# Altium project genfreq.PrjPCB
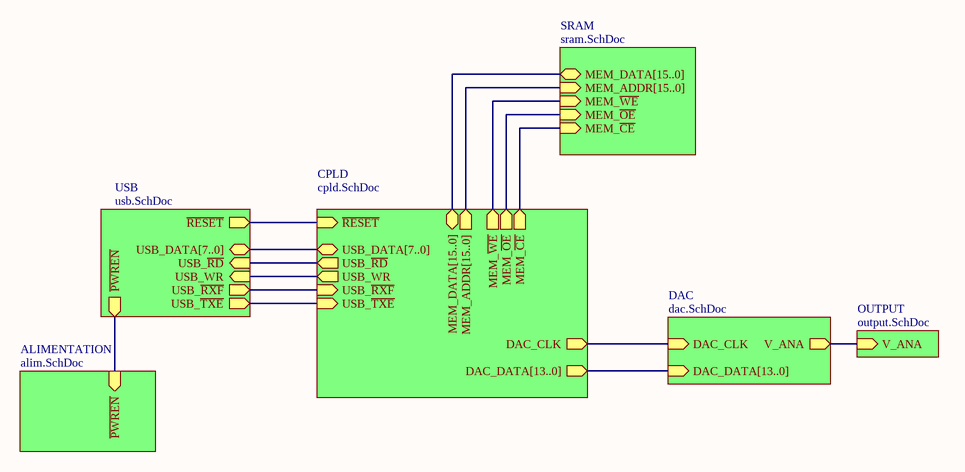
[diagram p0: global.SchDoc]
7 sheets, 119 parts. Net scope: hierarchical (ports join the sheet entries above them; power ports are global).
Board file: board.PcbDoc
Sheets:
  global.SchDoc
    USB = usb.SchDoc
    CPLD = cpld.SchDoc
    DAC = dac.SchDoc
    OUTPUT = output.SchDoc
    SRAM = sram.SchDoc
    ALIMENTATION = alim.SchDoc

## Sheet global.SchDoc
size A4

### Sub-sheets
ALIMENTATION = alim.SchDoc: ~{PWREN} (in)
CPLD = cpld.SchDoc: ~{RESET} (in), DAC_DATA[13..0] (out), USB_DATA[7..0] (bidir), USB_~{RD} (out), USB_WR (out), USB_~{RXF} (in), USB_~{TXE} (in), MEM_ADDR[15..0] (out), MEM_~{WE} (out), MEM_~{OE} (out), MEM_~{CE} (out), DAC_CLK (out), MEM_DATA[15..0] (bidir)
DAC = dac.SchDoc: V_ANA (out), DAC_DATA[13..0] (in), DAC_CLK (in)
OUTPUT = output.SchDoc: V_ANA (in)
SRAM = sram.SchDoc: MEM_DATA[15..0] (bidir), MEM_ADDR[15..0] (in), MEM_~{WE} (in), MEM_~{OE} (in), MEM_~{CE} (in)
USB = usb.SchDoc: ~{PWREN} (out), ~{RESET} (out), USB_DATA[7..0] (bidir), USB_~{RD} (in), USB_WR (in), USB_~{TXE} (out), USB_~{RXF} (out)

### Nets
DAC_CLK: sheet CPLD/DAC_CLK, sheet DAC/DAC_CLK
MEM_~{CE}: sheet CPLD/MEM_~{CE}, sheet SRAM/MEM_~{CE}
MEM_~{OE}: sheet CPLD/MEM_~{OE}, sheet SRAM/MEM_~{OE}
MEM_~{WE}: sheet CPLD/MEM_~{WE}, sheet SRAM/MEM_~{WE}
~{PWREN}: sheet USB/~{PWREN}, sheet ALIMENTATION/~{PWREN}
NetCPLD_28: sheet USB/USB_~{TXE}, sheet CPLD/USB_~{TXE}
NetCPLD_29: sheet USB/USB_~{RXF}, sheet CPLD/USB_~{RXF}
NetCPLD_30: sheet USB/USB_WR, sheet CPLD/USB_WR
NetCPLD_32: sheet USB/USB_~{RD}, sheet CPLD/USB_~{RD}
NetCPLD_44: sheet USB/~{RESET}, sheet CPLD/~{RESET}
NetDAC_22: sheet DAC/V_ANA, sheet OUTPUT/V_ANA

### Buses and harness runs
bus sheet CPLD/DAC_DATA[13..0] = sheet DAC/DAC_DATA[13..0]
bus sheet CPLD/MEM_ADDR[15..0] = sheet SRAM/MEM_ADDR[15..0]
bus sheet CPLD/MEM_DATA[15..0] = sheet SRAM/MEM_DATA[15..0]
bus sheet CPLD/USB_DATA[7..0] = sheet USB/USB_DATA[7..0]

## Sheet usb.SchDoc
size A4
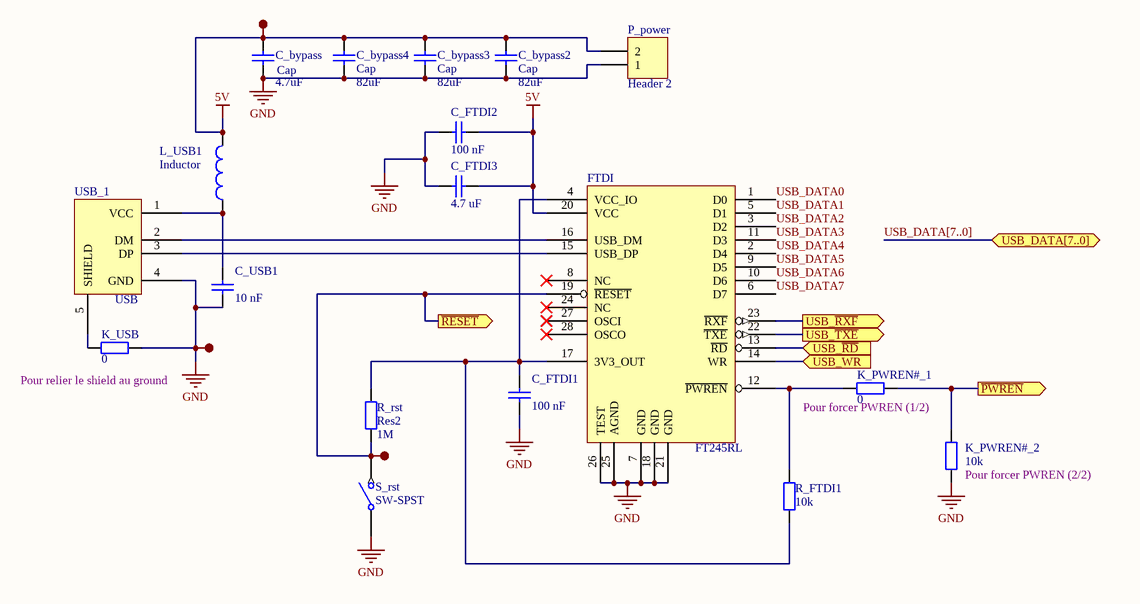
[diagram p1: usb.SchDoc]

### Parts
C_bypass  Cap  value 4.7uF  [0805]
C_bypass2  Cap  value 82uF  [Capacitor_bypass]
C_bypass3  Cap  value 82uF  [Capacitor_bypass]
C_bypass4  Cap  value 82uF  [Capacitor_bypass]
C_FTDI1  value 100 nF  [0805]  (hidden comment: Cap)
C_FTDI2  value 100 nF  [0805]  (hidden comment: Cap)
C_FTDI3  value 4.7 uF  [0805]  (hidden comment: Cap)
C_USB1  value 10 nF  [0805]  (hidden comment: Cap)
FTDI  FT245RL  [SSOP28]
K_PWREN#_1  value 0  [0805]  (hidden comment: Res2)
K_PWREN#_2  value 10k  [0805]  (hidden comment: Res2)
K_USB  value 0  [0805]  (hidden comment: Res2)
L_USB1  Inductor  [0805]
P_power  Header 2  [HDR1X2]
R_FTDI1  value 10k  [0805]  (hidden comment: Res2)
R_rst  Res2  value 1M  [0805]
S_rst  SW-SPST  [0805]
TP_5v  TestPoint  [testpoint]  (value not drawn)
TP_gnd  TestPoint  [testpoint]  (value not drawn)
TP_reset  TestPoint  [testpoint]  (value not drawn)
USB_1  USB  [USB2.5-2H4E]

### Ports
USB_DATA[7..0] (bidir), USB_WR (in), USB_~{RD} (in), USB_~{RXF} (out), USB_~{TXE} (out), ~{PWREN} (out), ~{RESET} (out)

### Nets
5V: C_bypass.1 C_bypass2.1 C_bypass3.1 C_bypass4.1 C_FTDI2.2 C_FTDI3.2 FTDI.20(VCC) L_USB1.2 P_power.2 TP_5v.1(TP)
GND: C_bypass.2 C_bypass2.2 C_bypass3.2 C_bypass4.2 C_FTDI1.2 C_FTDI2.1 C_FTDI3.1 C_USB1.2 FTDI.7(GND) FTDI.18(GND) FTDI.21(GND) FTDI.25(AGND) FTDI.26(TEST) K_PWREN#_2.2 K_USB.2 P_power.1 S_rst.1(COMMON) TP_gnd.1(TP) USB_1.4(GND)  [project net AGND]
~{PWREN}: K_PWREN#_1.2 K_PWREN#_2.1 ; port ~{PWREN}
USB_DATA0: FTDI.1(D0)
USB_DATA1: FTDI.5(D1)
USB_DATA2: FTDI.3(D2)
USB_DATA3: FTDI.11(D3)
USB_DATA4: FTDI.2(D4)
USB_DATA5: FTDI.9(D5)
USB_DATA6: FTDI.10(D6)
USB_DATA7: FTDI.6(D7)
NetC_FTDI1_1: C_FTDI1.1 FTDI.4(VCC_IO) FTDI.17(3V3_OUT) R_FTDI1.2 R_rst.2
NetC_USB1_1: C_USB1.1 L_USB1.1 USB_1.1(VCC)
NetCPLD_28: FTDI.22(~{TXE}) ; port USB_~{TXE}
NetCPLD_29: FTDI.23(~{RXF}) ; port USB_~{RXF}
NetCPLD_30: FTDI.14(WR) ; port USB_WR
NetCPLD_32: FTDI.13(~{RD}) ; port USB_~{RD}
NetCPLD_44: FTDI.19(~{RESET}) R_rst.1 S_rst.2(NO) TP_reset.1(TP) ; port ~{RESET}
NetFTDI_12: FTDI.12(~{PWREN}) K_PWREN#_1.1 R_FTDI1.1
NetFTDI_15: FTDI.15(USB_DP) USB_1.3(DP)
NetFTDI_16: FTDI.16(USB_DM) USB_1.2(DM)
NetK_USB_1: K_USB.1 USB_1.5(SHIELD)

Not connected (* = marked no-connect by the designer): FTDI 8(NC)* 24(NC)* 27(OSCI)* 28(OSCO)*

### Buses and harness runs
bus USB_DATA[7..0] = port USB_DATA[7..0]

### Notes on the sheet
- Pour relier le shield au ground
- (near K_PWREN#_1) Pour forcer PWREN (1/2)
- (near K_PWREN#_2) Pour forcer PWREN (2/2)

### Library data of the parts
C_bypass C_bypass2-C_bypass4 C_FTDI1-C_FTDI3 C_USB1 = Cap: Capacitor; Published: 8-Jun-2000; LatestRevisionDate: 17-Jul-2002; LatestRevisionNote: Re-released for DXP Platform.; PackageReference: RAD-0.3; Publisher: Altium Limited
K_PWREN#_1 K_PWREN#_2 K_USB R_FTDI1 R_rst = Res2: Resistor; Published: 8-Jun-2000; LatestRevisionDate: 17-Jul-2002; LatestRevisionNote: Re-released for DXP Platform.; PackageReference: AXIAL-0.4; Publisher: Altium Limited
L_USB1 = Inductor: Code_IEC: 1005; Published: 8-Jun-2000; LatestRevisionDate: 29-May-2009; LatestRevisionNote: IPC-7351 Footprint Added.; PackageReference: 0402-A; Publisher: Altium Limited; PackageDescription: Chip Inductor; Code_JEITA: 0402
P_power = Header 2: Header, 2-Pin; LatestRevisionDate: 17-Jul-2002; LatestRevisionNote: Re-released for DXP Platform.; Publisher: Altium Limited
S_rst = SW-SPST: Single-Pole, Single-Throw Switch; Published: 24-Mar-1999; LatestRevisionDate: 17-Jul-2002; LatestRevisionNote: Re-released for DXP Platform.; PackageReference: SPST-2; Publisher: Altium Limited

## Sheet cpld.SchDoc
size A4
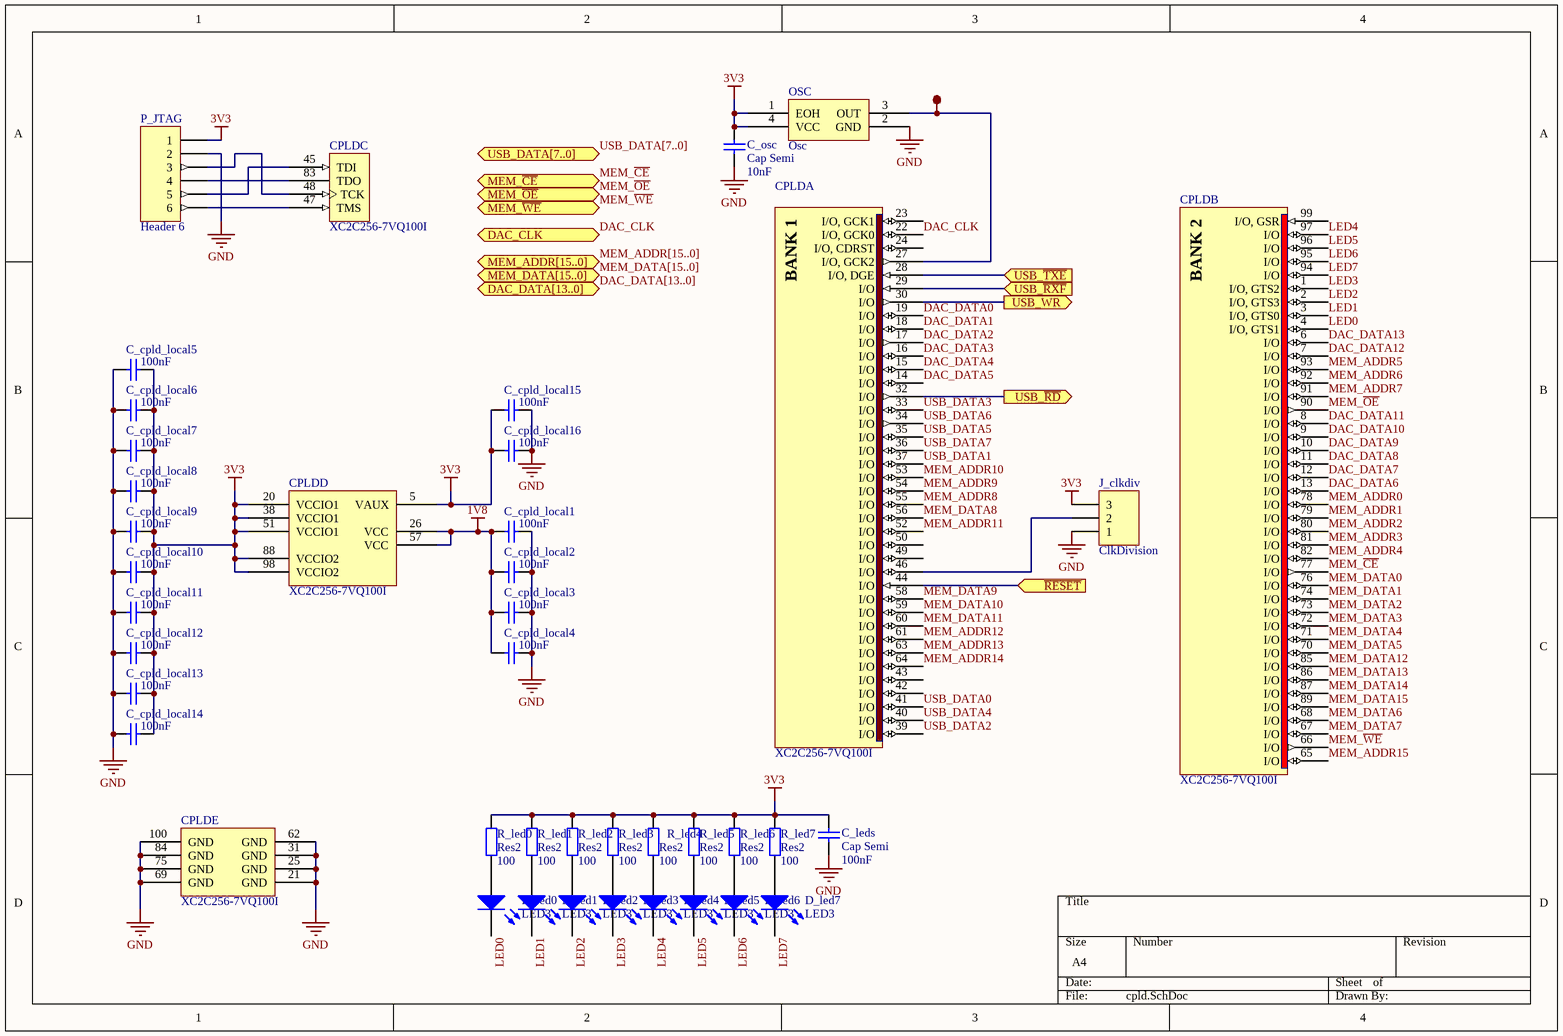
[diagram p2: cpld.SchDoc]

### Parts
C_cpld_local1  value 100nF  [0805]  (hidden comment: Cap Semi)
C_cpld_local2  value 100nF  [0805]  (hidden comment: Cap Semi)
C_cpld_local3  value 100nF  [0805]  (hidden comment: Cap Semi)
C_cpld_local4  value 100nF  [0805]  (hidden comment: Cap Semi)
C_cpld_local5  value 100nF  [0805]  (hidden comment: Cap Semi)
C_cpld_local6  value 100nF  [0805]  (hidden comment: Cap Semi)
C_cpld_local7  value 100nF  [0805]  (hidden comment: Cap Semi)
C_cpld_local8  value 100nF  [0805]  (hidden comment: Cap Semi)
C_cpld_local9  value 100nF  [0805]  (hidden comment: Cap Semi)
C_cpld_local10  value 100nF  [0805]  (hidden comment: Cap Semi)
C_cpld_local11  value 100nF  [0805]  (hidden comment: Cap Semi)
C_cpld_local12  value 100nF  [0805]  (hidden comment: Cap Semi)
C_cpld_local13  value 100nF  [0805]  (hidden comment: Cap Semi)
C_cpld_local14  value 100nF  [0805]  (hidden comment: Cap Semi)
C_cpld_local15  value 100nF  [0805]  (hidden comment: Cap Semi)
C_cpld_local16  value 100nF  [0805]  (hidden comment: Cap Semi)
C_leds  Cap Semi  value 100nF  [0805]
C_osc  Cap Semi  value 10nF  [0805]
CPLD  XC2C256-7VQ100I  [VQ100_N]  (parts A,B,C,D,E of 5)
D_led0  LED3  [0805]
D_led1  LED3  [0805]
D_led2  LED3  [0805]
D_led3  LED3  [0805]
D_led4  LED3  [0805]
D_led5  LED3  [0805]
D_led6  LED3  [0805]
D_led7  LED3  [0805]
J_clkdiv  ClkDivision  [HDR1X3]
OSC  Osc  [OSC]
P_JTAG  Header 6  [HDR1X6]
R_led0  Res2  value 100  [0805]
R_led1  Res2  value 100  [0805]
R_led2  Res2  value 100  [0805]
R_led3  Res2  value 100  [0805]
R_led4  Res2  value 100  [0805]
R_led5  Res2  value 100  [0805]
R_led6  Res2  value 100  [0805]
R_led7  Res2  value 100  [0805]
TP_osc  TestPoint  [testpoint]  (value not drawn)

### Ports
DAC_CLK (out), DAC_DATA[13..0] (out), MEM_ADDR[15..0] (out), MEM_DATA[15..0] (bidir), MEM_~{CE} (out), MEM_~{OE} (out), MEM_~{WE} (out), USB_DATA[7..0] (bidir), USB_WR (out), USB_~{RD} (out), USB_~{RXF} (in), USB_~{TXE} (in), ~{RESET} (in)

### Nets
1V8: C_cpld_local1.2 C_cpld_local2.2 C_cpld_local3.2 C_cpld_local4.2 CPLD.26(VCC) CPLD.57(VCC)
3V3: C_cpld_local5.1 C_cpld_local6.1 C_cpld_local7.1 C_cpld_local8.1 C_cpld_local9.1 C_cpld_local10.1 C_cpld_local11.1 C_cpld_local12.1 C_cpld_local13.1 C_cpld_local14.1 C_cpld_local15.2 C_cpld_local16.2 C_leds.2 C_osc.2 CPLD.5(VAUX) CPLD.20(VCCIO1) CPLD.38(VCCIO1) CPLD.51(VCCIO1) CPLD.88(VCCIO2) CPLD.98(VCCIO2) J_clkdiv.3 OSC.1(EOH) OSC.4(VCC) P_JTAG.1 R_led0.2 R_led1.2 R_led2.2 R_led3.2 R_led4.2 R_led5.2 R_led6.2 R_led7.2
GND: C_cpld_local1.1 C_cpld_local2.1 C_cpld_local3.1 C_cpld_local4.1 C_cpld_local5.2 C_cpld_local6.2 C_cpld_local7.2 C_cpld_local8.2 C_cpld_local9.2 C_cpld_local10.2 C_cpld_local11.2 C_cpld_local12.2 C_cpld_local13.2 C_cpld_local14.2 C_cpld_local15.1 C_cpld_local16.1 C_leds.1 C_osc.1 CPLD.21(GND) CPLD.25(GND) CPLD.31(GND) CPLD.62(GND) CPLD.69(GND) CPLD.75(GND) CPLD.84(GND) CPLD.100(GND) J_clkdiv.1 OSC.2(GND) P_JTAG.2  [project net AGND]
DAC_CLK: CPLD.22(I/O,_GCK0) ; port DAC_CLK
DAC_DATA0: CPLD.19(I/O)
DAC_DATA1: CPLD.18(I/O)
DAC_DATA2: CPLD.17(I/O)
DAC_DATA3: CPLD.16(I/O)
DAC_DATA4: CPLD.15(I/O)
DAC_DATA5: CPLD.14(I/O)
DAC_DATA6: CPLD.13(I/O)
DAC_DATA7: CPLD.12(I/O)
DAC_DATA8: CPLD.11(I/O)
DAC_DATA9: CPLD.10(I/O)
DAC_DATA10: CPLD.9(I/O)
DAC_DATA11: CPLD.8(I/O)
DAC_DATA12: CPLD.7(I/O)
DAC_DATA13: CPLD.6(I/O)
LED0: CPLD.4(I/O,_GTS1) D_led0.2(K)
LED1: CPLD.3(I/O,_GTS0) D_led1.2(K)
LED2: CPLD.2(I/O,_GTS3) D_led2.2(K)
LED3: CPLD.1(I/O,_GTS2) D_led3.2(K)
LED4: CPLD.97(I/O) D_led4.2(K)
LED5: CPLD.96(I/O) D_led5.2(K)
LED6: CPLD.95(I/O) D_led6.2(K)
LED7: CPLD.94(I/O) D_led7.2(K)
MEM_ADDR0: CPLD.78(I/O)
MEM_ADDR1: CPLD.79(I/O)
MEM_ADDR2: CPLD.80(I/O)
MEM_ADDR3: CPLD.81(I/O)
MEM_ADDR4: CPLD.82(I/O)
MEM_ADDR5: CPLD.93(I/O)
MEM_ADDR6: CPLD.92(I/O)
MEM_ADDR7: CPLD.91(I/O)
MEM_ADDR8: CPLD.55(I/O)
MEM_ADDR9: CPLD.54(I/O)
MEM_ADDR10: CPLD.53(I/O)
MEM_ADDR11: CPLD.52(I/O)
MEM_ADDR12: CPLD.61(I/O)
MEM_ADDR13: CPLD.63(I/O)
MEM_ADDR14: CPLD.64(I/O)
MEM_ADDR15: CPLD.65(I/O)
MEM_~{CE}: CPLD.77(I/O) ; port MEM_~{CE}
MEM_DATA0: CPLD.76(I/O)
MEM_DATA1: CPLD.74(I/O)
MEM_DATA2: CPLD.73(I/O)
MEM_DATA3: CPLD.72(I/O)
MEM_DATA4: CPLD.71(I/O)
MEM_DATA5: CPLD.70(I/O)
MEM_DATA6: CPLD.68(I/O)
MEM_DATA7: CPLD.67(I/O)
MEM_DATA8: CPLD.56(I/O)
MEM_DATA9: CPLD.58(I/O)
MEM_DATA10: CPLD.59(I/O)
MEM_DATA11: CPLD.60(I/O)
MEM_DATA12: CPLD.85(I/O)
MEM_DATA13: CPLD.86(I/O)
MEM_DATA14: CPLD.87(I/O)
MEM_DATA15: CPLD.89(I/O)
MEM_~{OE}: CPLD.90(I/O) ; port MEM_~{OE}
MEM_~{WE}: CPLD.66(I/O) ; port MEM_~{WE}
USB_DATA0: CPLD.41(I/O)
USB_DATA1: CPLD.37(I/O)
USB_DATA2: CPLD.39(I/O)
USB_DATA3: CPLD.33(I/O)
USB_DATA4: CPLD.40(I/O)
USB_DATA5: CPLD.35(I/O)
USB_DATA6: CPLD.34(I/O)
USB_DATA7: CPLD.36(I/O)
NetCPLD_27: CPLD.27(I/O,_GCK2) OSC.3(OUT) TP_osc.1(TP)
NetCPLD_28: CPLD.28(I/O,_DGE) ; port USB_~{TXE}
NetCPLD_29: CPLD.29(I/O) ; port USB_~{RXF}
NetCPLD_30: CPLD.30(I/O) ; port USB_WR
NetCPLD_32: CPLD.32(I/O) ; port USB_~{RD}
NetCPLD_44: CPLD.44(I/O) ; port ~{RESET}
NetCPLD_45: CPLD.45(TDI) P_JTAG.5
NetCPLD_46: CPLD.46(I/O) J_clkdiv.2
NetCPLD_47: CPLD.47(TMS) P_JTAG.6
NetCPLD_48: CPLD.48(TCK) P_JTAG.3
NetCPLD_83: CPLD.83(TDO) P_JTAG.4
NetD_led0_1: D_led0.1(A) R_led0.1
NetD_led1_1: D_led1.1(A) R_led1.1
NetD_led2_1: D_led2.1(A) R_led2.1
NetD_led3_1: D_led3.1(A) R_led3.1
NetD_led4_1: D_led4.1(A) R_led4.1
NetD_led5_1: D_led5.1(A) R_led5.1
NetD_led6_1: D_led6.1(A) R_led6.1
NetD_led7_1: D_led7.1(A) R_led7.1

Not connected (* = marked no-connect by the designer): CPLD 23(I/O,_GCK1) 24(I/O,_CDRST) 42(I/O) 43(I/O) 49(I/O) 50(I/O) 99(I/O,_GSR)

### Buses and harness runs
bus DAC_DATA[13..0] = port DAC_DATA[13..0]
bus MEM_ADDR[15..0] = port MEM_ADDR[15..0]
bus MEM_DATA[15..0] = port MEM_DATA[15..0]
bus USB_DATA[7..0] = port USB_DATA[7..0]

### Notes on the sheet
- (in symbol XC2C256-7VQ100I, part A) BANK 1
- (in symbol XC2C256-7VQ100I, part B) BANK 2

### Library data of the parts
C_cpld_local1-C_cpld_local16 C_leds C_osc = Cap Semi: Capacitor (Semiconductor SIM Model); Published: 8-Jun-2000; LatestRevisionDate: 29-May-2009; LatestRevisionNote: IPC-7351 Footprint Added.; PackageReference: C1206; Publisher: Altium Limited; PackageDescription: Chip Capacitor
CPLD = XC2C256-7VQ100I: CoolRunner-II 1.8V, 256 Macrocell CPLD, 80 User I/Os, 100-Pin VQFP, Industrial Grade; FirstPublished: 23-Sep-2002; LatestRevisionDate: 30-Oct-2009; LatestRevisionNote: Updated to datasheet version 3.1 Sep-2008.; DatasheetVersion: ver3.2, Mar-2007; PackageVersion: ver1.2.1, Feb-2007; PackageReference: VQ100; Publisher: Altium Limited; PackageDescription: 100-Pin Very Thin Quad Flat Pack (VQ100); Code_JEDEC: MS-026-AED; ComponentLink1Description: XC2C256 Datasheet; ComponentLink1URL: http://www.xilinx.com/support/documentation/data_sheets/ds094.pdf; ComponentLink2Description: VQ100 Package Drawing; ComponentLink2URL: http://www.xilinx.com/support/documentation/package_specs/vq100.pdf; ComponentLink3Description: CoolRunner-II Documents; ComponentLink3URL: http://www.xilinx.com/support/documentation/coolrunner-ii.htm; ComponentLink4Description: Xilinx.com Home; ComponentLink4URL: http://www.xilinx.com
D_led0-D_led7 = LED3: Typical BLUE SiC LED; Published: 8-Jun-2000; LatestRevisionDate: 17-Dec-2003; LatestRevisionNote: PCB Footprint replaced.; DatasheetVersion: 16-Apr-2002; PackageVersion: 16-Apr-2002; PackageReference: 3.5X2.8X1.9; Publisher: Altium Limited
J_clkdiv = Header 3: Header, 3-Pin; LatestRevisionDate: 17-Jul-2002; LatestRevisionNote: Re-released for DXP Platform.; Publisher: Altium Limited
P_JTAG = Header 6: Header, 6-Pin; LatestRevisionDate: 17-Jul-2002; LatestRevisionNote: Re-released for DXP Platform.; Publisher: Altium Limited
R_led0-R_led7 = Res2: Resistor; Published: 8-Jun-2000; LatestRevisionDate: 17-Jul-2002; LatestRevisionNote: Re-released for DXP Platform.; PackageReference: AXIAL-0.4; Publisher: Altium Limited

## Sheet dac.SchDoc
size A4
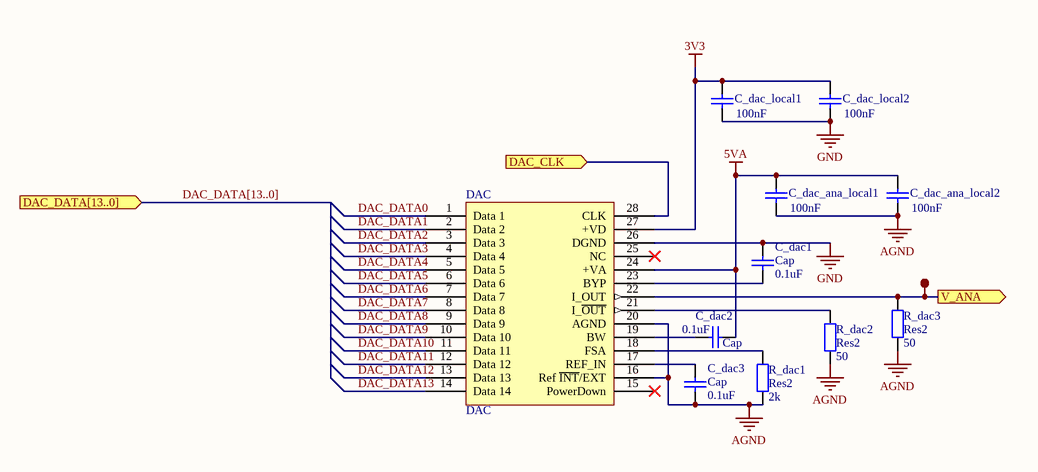
[diagram p3: dac.SchDoc]

### Parts
C_dac1  Cap  value 0.1uF  [0805]
C_dac2  Cap  value 0.1uF  [0805]
C_dac3  Cap  value 0.1uF  [0805]
C_dac_ana_local1  value 100nF  [0805]  (hidden comment: Cap Semi)
C_dac_ana_local2  value 100nF  [0805]  (hidden comment: Cap Semi)
C_dac_local1  value 100nF  [0805]  (hidden comment: Cap Semi)
C_dac_local2  value 100nF  [0805]  (hidden comment: Cap Semi)
DAC  DAC  [SOIC28]
R_dac1  Res2  value 2k  [0805]
R_dac2  Res2  value 50  [0805]
R_dac3  Res2  value 50  [0805]
TP_vout  TestPoint  [testpoint]  (value not drawn)

### Ports
DAC_CLK (in), DAC_DATA[13..0] (in), V_ANA (out)

### Nets
3V3: C_dac_local1.2 C_dac_local2.2 DAC.27(+VD)
5VA: C_dac2.1 C_dac_ana_local1.2 C_dac_ana_local2.2 DAC.24(+VA)
AGND: C_dac1.1 C_dac3.2 C_dac_ana_local1.1 C_dac_ana_local2.1 C_dac_local1.1 C_dac_local2.1 DAC.16(Ref_~{INT}/EXT) DAC.20(AGND) DAC.26(DGND) R_dac1.1 R_dac2.1 R_dac3.1  [also labelled GND]
DAC_CLK: DAC.28(CLK) ; port DAC_CLK
DAC_DATA0: DAC.1(Data_1)
DAC_DATA1: DAC.2(Data_2)
DAC_DATA2: DAC.3(Data_3)
DAC_DATA3: DAC.4(Data_4)
DAC_DATA4: DAC.5(Data_5)
DAC_DATA5: DAC.6(Data_6)
DAC_DATA6: DAC.7(Data_7)
DAC_DATA7: DAC.8(Data_8)
DAC_DATA8: DAC.9(Data_9)
DAC_DATA9: DAC.10(Data_10)
DAC_DATA10: DAC.11(Data_11)
DAC_DATA11: DAC.12(Data_12)
DAC_DATA12: DAC.13(Data_13)
DAC_DATA13: DAC.14(Data_14)
NetC_dac1_2: C_dac1.2 DAC.23(BYP)
NetC_dac2_2: C_dac2.2 DAC.19(BW)
NetC_dac3_1: C_dac3.1 DAC.17(REF_IN)
NetDAC_18: DAC.18(FSA) R_dac1.2
NetDAC_21: DAC.21(I_~{OUT}) R_dac2.2
NetDAC_22: DAC.22(I_OUT) R_dac3.2 TP_vout.1(TP) ; port V_ANA

Not connected (* = marked no-connect by the designer): DAC 15(PowerDown)* 25(NC)*

### Buses and harness runs
bus DAC_DATA[13..0] = port DAC_DATA[13..0]

### Library data of the parts
C_dac1-C_dac3 = Cap: Capacitor; Published: 8-Jun-2000; LatestRevisionDate: 17-Jul-2002; LatestRevisionNote: Re-released for DXP Platform.; PackageReference: RAD-0.3; Publisher: Altium Limited
C_dac_ana_local1 C_dac_ana_local2 C_dac_local1 C_dac_local2 = Cap Semi: Capacitor (Semiconductor SIM Model); Published: 8-Jun-2000; LatestRevisionDate: 29-May-2009; LatestRevisionNote: IPC-7351 Footprint Added.; PackageReference: C1206; Publisher: Altium Limited; PackageDescription: Chip Capacitor
R_dac1-R_dac3 = Res2: Resistor; Published: 8-Jun-2000; LatestRevisionDate: 17-Jul-2002; LatestRevisionNote: Re-released for DXP Platform.; PackageReference: AXIAL-0.4; Publisher: Altium Limited

## Sheet output.SchDoc
size A4
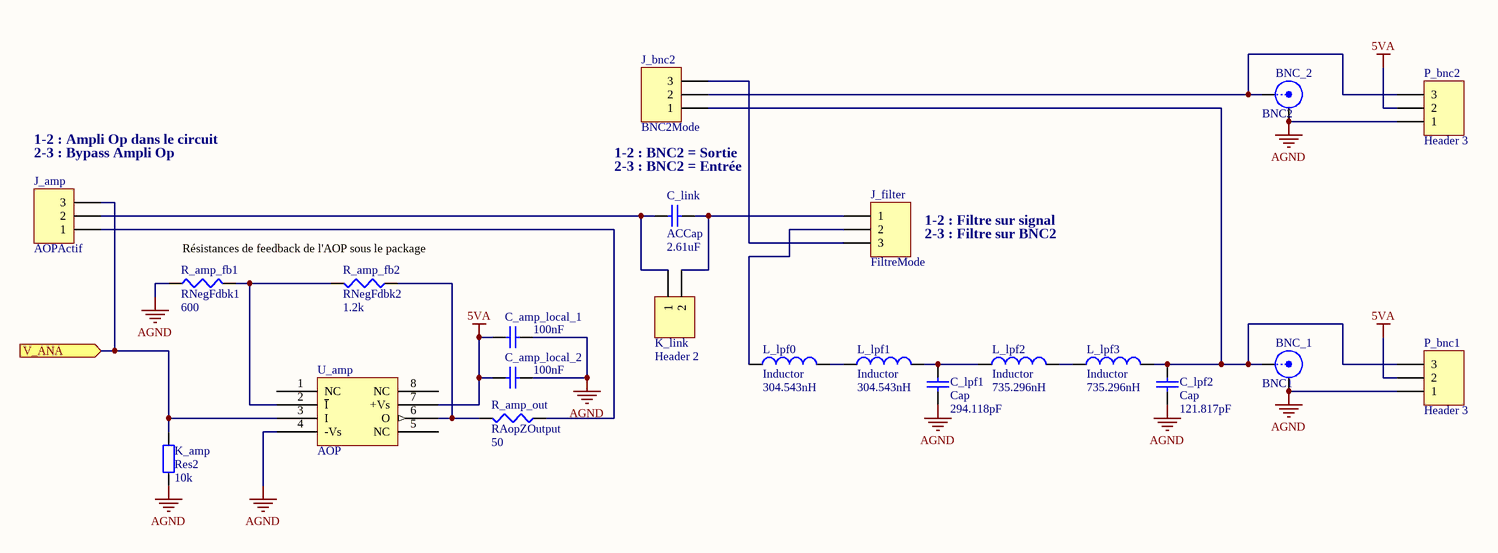
[diagram p4: output.SchDoc]

### Parts
BNC_1  BNC1  [BNC_RA CON]
BNC_2  BNC2  [BNC_RA CON]
C_amp_local_1  value 100nF  [0805]  (hidden comment: Cap Semi)
C_amp_local_2  value 100nF  [0805]  (hidden comment: Cap Semi)
C_link  ACCap  value 2.61uF  [0805]
C_lpf1  Cap  value 294.118pF  [0805]
C_lpf2  Cap  value 121.817pF  [0805]
J_amp  AOPActif  [HDR1X3]
J_bnc2  BNC2Mode  [HDR1X3]
J_filter  FiltreMode  [HDR1X3]
K_amp  Res2  value 10k  [0805]
K_link  Header 2  [HDR1X2]
L_lpf0  Inductor  value 304.543nH  [0805]
L_lpf1  Inductor  value 304.543nH  [0805]
L_lpf2  Inductor  value 735.296nH  [0805]
L_lpf3  Inductor  value 735.296nH  [0805]
P_bnc1  Header 3  [HDR1X3]
P_bnc2  Header 3  [HDR1X3]
R_amp_fb1  RNegFdbk1  value 600  [0805]
R_amp_fb2  RNegFdbk2  value 1.2k  [0805]
R_amp_out  RAopZOutput  value 50  [0805]
U_amp  AOP  [SOIC127P600-8CN]

### Ports
V_ANA (in)

### Nets
5VA: C_amp_local_1.2 C_amp_local_2.2 P_bnc1.2 P_bnc2.2 U_amp.7(+Vs)
AGND: BNC_1.2(Y) BNC_2.2(Y) C_amp_local_1.1 C_amp_local_2.1 C_lpf1.1 C_lpf2.1 K_amp.1 P_bnc1.1 P_bnc2.1 R_amp_fb1.1 U_amp.4(-Vs)
NetBNC_1_1: BNC_1.1(X) C_lpf2.2 J_bnc2.1 L_lpf3.2 P_bnc1.3
NetBNC_2_1: BNC_2.1(X) J_bnc2.2 P_bnc2.3
NetC_link_1: C_link.1 J_amp.2 K_link.1
NetC_link_2: C_link.2 J_filter.1 K_link.2
NetC_lpf1_2: C_lpf1.2 L_lpf1.2 L_lpf2.1
NetDAC_22: J_amp.3 K_amp.2 U_amp.3(I) ; port V_ANA
NetJ_amp_1: J_amp.1 R_amp_out.1
NetJ_bnc2_3: J_bnc2.3 J_filter.3
NetJ_filter_2: J_filter.2 L_lpf0.1
NetL_lpf0_2: L_lpf0.2 L_lpf1.1
NetL_lpf2_2: L_lpf2.2 L_lpf3.1
NetR_amp_fb1_2: R_amp_fb1.2 R_amp_fb2.2 U_amp.2(~{I})
NetR_amp_fb2_1: R_amp_fb2.1 R_amp_out.2 U_amp.6(O)

Not connected (* = marked no-connect by the designer): U_amp 1(NC) 5(NC) 8(NC)

### Notes on the sheet
- 1-2 : Ampli Op dans le circuit
- (near J_amp) 2-3 : Bypass Ampli Op
- 1-2 : BNC2 = Sortie
- 2-3 : BNC2 = Entrée
- Résistances de feedback de l'AOP sous le package
- 1-2 : Filtre sur signal
- 2-3 : Filtre sur BNC2

### Library data of the parts
BNC_1 BNC_2 = BNC: BNC Elbow Connector; LatestRevisionDate: 17-Jul-2002; LatestRevisionNote: Re-released for DXP Platform.; Publisher: Altium Limited
C_amp_local_1 C_amp_local_2 = Cap Semi: Capacitor (Semiconductor SIM Model); Published: 8-Jun-2000; LatestRevisionDate: 29-May-2009; LatestRevisionNote: IPC-7351 Footprint Added.; PackageReference: C1206; Publisher: Altium Limited; PackageDescription: Chip Capacitor
C_link C_lpf1 C_lpf2 = Cap: Capacitor; Published: 8-Jun-2000; LatestRevisionDate: 17-Jul-2002; LatestRevisionNote: Re-released for DXP Platform.; PackageReference: RAD-0.3; Publisher: Altium Limited
J_amp J_bnc2 J_filter P_bnc1 P_bnc2 = Header 3: Header, 3-Pin; LatestRevisionDate: 17-Jul-2002; LatestRevisionNote: Re-released for DXP Platform.; Publisher: Altium Limited
K_amp = Res2: Resistor; Published: 8-Jun-2000; LatestRevisionDate: 17-Jul-2002; LatestRevisionNote: Re-released for DXP Platform.; PackageReference: AXIAL-0.4; Publisher: Altium Limited
K_link = Header 2: Header, 2-Pin; LatestRevisionDate: 17-Jul-2002; LatestRevisionNote: Re-released for DXP Platform.; Publisher: Altium Limited
L_lpf0-L_lpf3 = Inductor: Code_IEC: 1005; Published: 8-Jun-2000; LatestRevisionDate: 29-May-2009; LatestRevisionNote: IPC-7351 Footprint Added.; PackageReference: 0402-A; Publisher: Altium Limited; PackageDescription: Chip Inductor; Code_JEITA: 0402
R_amp_fb1 R_amp_fb2 R_amp_out = Res3: Resistor; Published: 8-Jun-2000; LatestRevisionDate: 29-May-2009; LatestRevisionNote: IPC-7351 Footprint Added.; PackageReference: J1-0603; Publisher: Altium Limited; PackageDescription: Chip Resistor

## Sheet sram.SchDoc
size A4
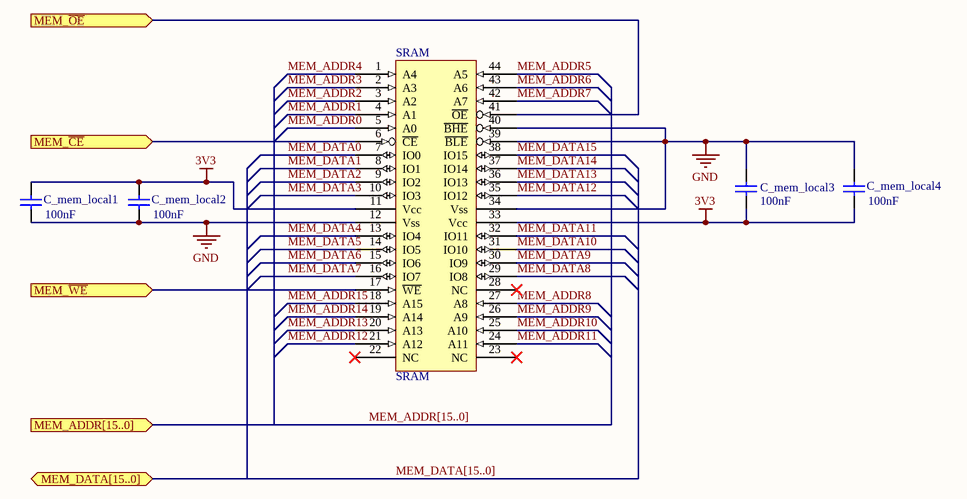
[diagram p5: sram.SchDoc]

### Parts
C_mem_local1  value 100nF  [0805]  (hidden comment: Cap Semi)
C_mem_local2  value 100nF  [0805]  (hidden comment: Cap Semi)
C_mem_local3  value 100nF  [0805]  (hidden comment: Cap Semi)
C_mem_local4  value 100nF  [0805]  (hidden comment: Cap Semi)
SRAM  SRAM  [TSOP44]

### Ports
MEM_ADDR[15..0] (in), MEM_DATA[15..0] (bidir), MEM_~{CE} (in), MEM_~{OE} (in), MEM_~{WE} (in)

### Nets
3V3: C_mem_local1.2 C_mem_local2.2 C_mem_local3.1 C_mem_local4.1 SRAM.11(Vcc) SRAM.33(Vcc)
GND: C_mem_local1.1 C_mem_local2.1 C_mem_local3.2 C_mem_local4.2 SRAM.12(Vss) SRAM.34(Vss) SRAM.39(~{BLE}) SRAM.40(~{BHE})  [project net AGND]
MEM_ADDR0: SRAM.5(A0)
MEM_ADDR1: SRAM.4(A1)
MEM_ADDR2: SRAM.3(A2)
MEM_ADDR3: SRAM.2(A3)
MEM_ADDR4: SRAM.1(A4)
MEM_ADDR5: SRAM.44(A5)
MEM_ADDR6: SRAM.43(A6)
MEM_ADDR7: SRAM.42(A7)
MEM_ADDR8: SRAM.27(A8)
MEM_ADDR9: SRAM.26(A9)
MEM_ADDR10: SRAM.25(A10)
MEM_ADDR11: SRAM.24(A11)
MEM_ADDR12: SRAM.21(A12)
MEM_ADDR13: SRAM.20(A13)
MEM_ADDR14: SRAM.19(A14)
MEM_ADDR15: SRAM.18(A15)
MEM_~{CE}: SRAM.6(~{CE}) ; port MEM_~{CE}
MEM_DATA0: SRAM.7(IO0)
MEM_DATA1: SRAM.8(IO1)
MEM_DATA2: SRAM.9(IO2)
MEM_DATA3: SRAM.10(IO3)
MEM_DATA4: SRAM.13(IO4)
MEM_DATA5: SRAM.14(IO5)
MEM_DATA6: SRAM.15(IO6)
MEM_DATA7: SRAM.16(IO7)
MEM_DATA8: SRAM.29(IO8)
MEM_DATA9: SRAM.30(IO9)
MEM_DATA10: SRAM.31(IO10)
MEM_DATA11: SRAM.32(IO11)
MEM_DATA12: SRAM.35(IO12)
MEM_DATA13: SRAM.36(IO13)
MEM_DATA14: SRAM.37(IO14)
MEM_DATA15: SRAM.38(IO15)
MEM_~{OE}: SRAM.41(~{OE}) ; port MEM_~{OE}
MEM_~{WE}: SRAM.17(~{WE}) ; port MEM_~{WE}

Not connected (* = marked no-connect by the designer): SRAM 22(NC)* 23(NC)* 28(NC)*

### Buses and harness runs
bus MEM_ADDR[15..0] = port MEM_ADDR[15..0]
bus MEM_DATA[15..0] = port MEM_DATA[15..0]

### Library data of the parts
C_mem_local1-C_mem_local4 = Cap Semi: Capacitor (Semiconductor SIM Model); Published: 8-Jun-2000; LatestRevisionDate: 29-May-2009; LatestRevisionNote: IPC-7351 Footprint Added.; PackageReference: C1206; Publisher: Altium Limited; PackageDescription: Chip Capacitor

## Sheet alim.SchDoc
size A4
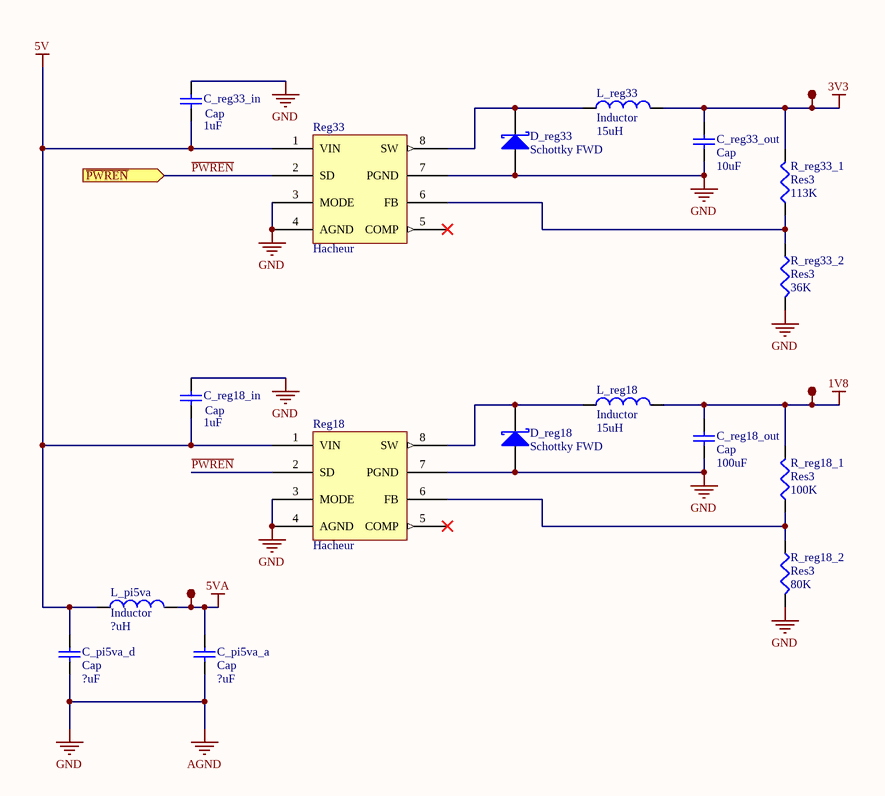
[diagram p6: alim.SchDoc]

### Parts
C_pi5va_a  Cap  value ?uF  [0805]
C_pi5va_d  Cap  value ?uF  [0805]
C_reg18_in  Cap  value 1uF  [0805]
C_reg18_out  Cap  value 100uF  [0805]
C_reg33_in  Cap  value 1uF  [0805]
C_reg33_out  Cap  value 10uF  [0805]
D_reg18  Schottky FWD  [Diode]
D_reg33  Schottky FWD  [Diode]
L_pi5va  Inductor  value ?uH  [0805]
L_reg18  Inductor  value 15uH  [Bobine_alim]
L_reg33  Inductor  value 15uH  [Bobine_alim]
R_reg18_1  Res3  value 100K  [0805]
R_reg18_2  Res3  value 80K  [0805]
R_reg33_1  Res3  value 113K  [0805]
R_reg33_2  Res3  value 36K  [0805]
Reg18  Hacheur  [SOIC8_M]
Reg33  Hacheur  [SOIC8_M]
TP_1v8  TestPoint  [testpoint]  (value not drawn)
TP_3v3  TestPoint  [testpoint]  (value not drawn)
TP_5va  TestPoint  [testpoint]  (value not drawn)

### Ports
~{PWREN} (in)

### Nets
1V8: C_reg18_out.1 L_reg18.2 R_reg18_1.2 TP_1v8.1(TP)
3V3: C_reg33_out.1 L_reg33.2 R_reg33_1.2 TP_3v3.1(TP)
5V: C_pi5va_d.1 C_reg18_in.2 C_reg33_in.2 L_pi5va.1 Reg18.1(VIN) Reg33.1(VIN)
5VA: C_pi5va_a.1 L_pi5va.2 TP_5va.1(TP)
AGND: C_pi5va_a.2 C_pi5va_d.2 C_reg18_in.1 C_reg18_out.2 C_reg33_in.1 C_reg33_out.2 D_reg18.1(A) D_reg33.1(A) R_reg18_2.2 R_reg33_2.2 Reg18.3(MODE) Reg18.4(AGND) Reg18.7(PGND) Reg33.3(MODE) Reg33.4(AGND) Reg33.7(PGND)  [also labelled GND]
~{PWREN}: Reg18.2(SD) Reg33.2(SD) ; port ~{PWREN}
NetD_reg18_2: D_reg18.2(K) L_reg18.1 Reg18.8(SW)
NetD_reg33_2: D_reg33.2(K) L_reg33.1 Reg33.8(SW)
NetR_reg18_1_1: R_reg18_1.1 R_reg18_2.1 Reg18.6(FB)
NetR_reg33_1_1: R_reg33_1.1 R_reg33_2.1 Reg33.6(FB)

Not connected (* = marked no-connect by the designer): Reg18 5(COMP)*; Reg33 5(COMP)*

### Library data of the parts
C_pi5va_a C_pi5va_d C_reg18_in C_reg18_out C_reg33_in C_reg33_out = Cap: Capacitor; Published: 8-Jun-2000; LatestRevisionDate: 17-Jul-2002; LatestRevisionNote: Re-released for DXP Platform.; PackageReference: RAD-0.3; Publisher: Altium Limited
D_reg18 D_reg33 = Diode BAT17: Silicon RF Schottky Diode for Mixer Applications in the VHF/UHF Range; Note: Pin 2 is not connected and not drawn.; Published: 21-Mar-2003; LatestRevisionDate: 29-May-2009; LatestRevisionNote: IPC-7351 Footprint Added.; DatasheetVersion: Oct-1999; PackageVersion: Sep-2001; PackageReference: SOT-23; Publisher: Altium Limited; PackageDescription: 3-Pin SOT-23 Package 0.95 mm Pitch, 2.5 mm Lead Span; ComponentLink1Description: Manufacturer Link; ComponentLink1URL: http://www.infineon.com/; ComponentLink2Description: Datasheet; ComponentLink2URL: http://www.infineon.com/upload/Document/cmc_upload/documents/009/363/bat17series.pdf
L_pi5va L_reg18 L_reg33 = Inductor: Code_IEC: 1005; Published: 8-Jun-2000; LatestRevisionDate: 29-May-2009; LatestRevisionNote: IPC-7351 Footprint Added.; PackageReference: 0402-A; Publisher: Altium Limited; PackageDescription: Chip Inductor; Code_JEITA: 0402
R_reg18_1 R_reg18_2 R_reg33_1 R_reg33_2 = Res3: Resistor; Published: 8-Jun-2000; LatestRevisionDate: 29-May-2009; LatestRevisionNote: IPC-7351 Footprint Added.; PackageReference: J1-0603; Publisher: Altium Limited; PackageDescription: Chip Resistor

## Nets that join several sheets
1V8: cpld (6 pins), alim (C_reg18_out.1 L_reg18.2 R_reg18_1.2 TP_1v8.1)
3V3: cpld (32 pins), dac (C_dac_local1.2 C_dac_local2.2 DAC.27), sram (6 pins), alim (C_reg33_out.1 L_reg33.2 R_reg33_1.2 TP_3v3.1)
5V: usb (10 pins), alim (6 pins)
5VA: dac (C_dac2.1 C_dac_ana_local1.2 C_dac_ana_local2.2 DAC.24), output (5 pins), alim (C_pi5va_a.1 L_pi5va.2 TP_5va.1)
AGND: usb (19 pins), cpld (29 pins), dac (12 pins), output (11 pins), sram (8 pins), alim (16 pins)
DAC_CLK: cpld (CPLD.22), dac (DAC.28)
DAC_DATA0: cpld (CPLD.19), dac (DAC.1)
DAC_DATA1: cpld (CPLD.18), dac (DAC.2)
DAC_DATA2: cpld (CPLD.17), dac (DAC.3)
DAC_DATA3: cpld (CPLD.16), dac (DAC.4)
DAC_DATA4: cpld (CPLD.15), dac (DAC.5)
DAC_DATA5: cpld (CPLD.14), dac (DAC.6)
DAC_DATA6: cpld (CPLD.13), dac (DAC.7)
DAC_DATA7: cpld (CPLD.12), dac (DAC.8)
DAC_DATA8: cpld (CPLD.11), dac (DAC.9)
DAC_DATA9: cpld (CPLD.10), dac (DAC.10)
DAC_DATA10: cpld (CPLD.9), dac (DAC.11)
DAC_DATA11: cpld (CPLD.8), dac (DAC.12)
DAC_DATA12: cpld (CPLD.7), dac (DAC.13)
DAC_DATA13: cpld (CPLD.6), dac (DAC.14)
MEM_ADDR0: cpld (CPLD.78), sram (SRAM.5)
MEM_ADDR1: cpld (CPLD.79), sram (SRAM.4)
MEM_ADDR2: cpld (CPLD.80), sram (SRAM.3)
MEM_ADDR3: cpld (CPLD.81), sram (SRAM.2)
MEM_ADDR4: cpld (CPLD.82), sram (SRAM.1)
MEM_ADDR5: cpld (CPLD.93), sram (SRAM.44)
MEM_ADDR6: cpld (CPLD.92), sram (SRAM.43)
MEM_ADDR7: cpld (CPLD.91), sram (SRAM.42)
MEM_ADDR8: cpld (CPLD.55), sram (SRAM.27)
MEM_ADDR9: cpld (CPLD.54), sram (SRAM.26)
MEM_ADDR10: cpld (CPLD.53), sram (SRAM.25)
MEM_ADDR11: cpld (CPLD.52), sram (SRAM.24)
MEM_ADDR12: cpld (CPLD.61), sram (SRAM.21)
MEM_ADDR13: cpld (CPLD.63), sram (SRAM.20)
MEM_ADDR14: cpld (CPLD.64), sram (SRAM.19)
MEM_ADDR15: cpld (CPLD.65), sram (SRAM.18)
MEM_~{CE}: cpld (CPLD.77), sram (SRAM.6)
MEM_DATA0: cpld (CPLD.76), sram (SRAM.7)
MEM_DATA1: cpld (CPLD.74), sram (SRAM.8)
MEM_DATA2: cpld (CPLD.73), sram (SRAM.9)
MEM_DATA3: cpld (CPLD.72), sram (SRAM.10)
MEM_DATA4: cpld (CPLD.71), sram (SRAM.13)
MEM_DATA5: cpld (CPLD.70), sram (SRAM.14)
MEM_DATA6: cpld (CPLD.68), sram (SRAM.15)
MEM_DATA7: cpld (CPLD.67), sram (SRAM.16)
MEM_DATA8: cpld (CPLD.56), sram (SRAM.29)
MEM_DATA9: cpld (CPLD.58), sram (SRAM.30)
MEM_DATA10: cpld (CPLD.59), sram (SRAM.31)
MEM_DATA11: cpld (CPLD.60), sram (SRAM.32)
MEM_DATA12: cpld (CPLD.85), sram (SRAM.35)
MEM_DATA13: cpld (CPLD.86), sram (SRAM.36)
MEM_DATA14: cpld (CPLD.87), sram (SRAM.37)
MEM_DATA15: cpld (CPLD.89), sram (SRAM.38)
MEM_~{OE}: cpld (CPLD.90), sram (SRAM.41)
MEM_~{WE}: cpld (CPLD.66), sram (SRAM.17)
NetCPLD_28: usb (FTDI.22), cpld (CPLD.28)
NetCPLD_29: usb (FTDI.23), cpld (CPLD.29)
NetCPLD_30: usb (FTDI.14), cpld (CPLD.30)
NetCPLD_32: usb (FTDI.13), cpld (CPLD.32)
NetCPLD_44: usb (FTDI.19 R_rst.1 S_rst.2 TP_reset.1), cpld (CPLD.44)
NetDAC_22: dac (DAC.22 R_dac3.2 TP_vout.1), output (J_amp.3 K_amp.2 U_amp.3)
~{PWREN}: usb (K_PWREN#_1.2 K_PWREN#_2.1), alim (Reg18.2 Reg33.2)
USB_DATA0: usb (FTDI.1), cpld (CPLD.41)
USB_DATA1: usb (FTDI.5), cpld (CPLD.37)
USB_DATA2: usb (FTDI.3), cpld (CPLD.39)
USB_DATA3: usb (FTDI.11), cpld (CPLD.33)
USB_DATA4: usb (FTDI.2), cpld (CPLD.40)
USB_DATA5: usb (FTDI.9), cpld (CPLD.35)
USB_DATA6: usb (FTDI.10), cpld (CPLD.34)
USB_DATA7: usb (FTDI.6), cpld (CPLD.36)